# Altium schematic sheet dv_analog_main.SchDoc: =GlobalProjectName
size 209 x 297 mm; DocumentNumber: 2; SheetNumber: 1; SheetTotal: 2; PageSetup: Record=PageOptions|CenterHorizontal=True|CenterVertical=True|PrintScale=1.00|XCorrection=1.00|YCorrection=1.00|PrintKind=1|BorderSize=5000000|LeftOffset=0|BottomOffset=0|Orientation=2|PaperLength=1000|PaperWidth=1000|Scale=100|PaperSource=15|PrintQuality=1200|MediaType=1|DitherType=10|PaperKind=A3|PrintScaleMode=1; Weight: -; ScaleFactor: -
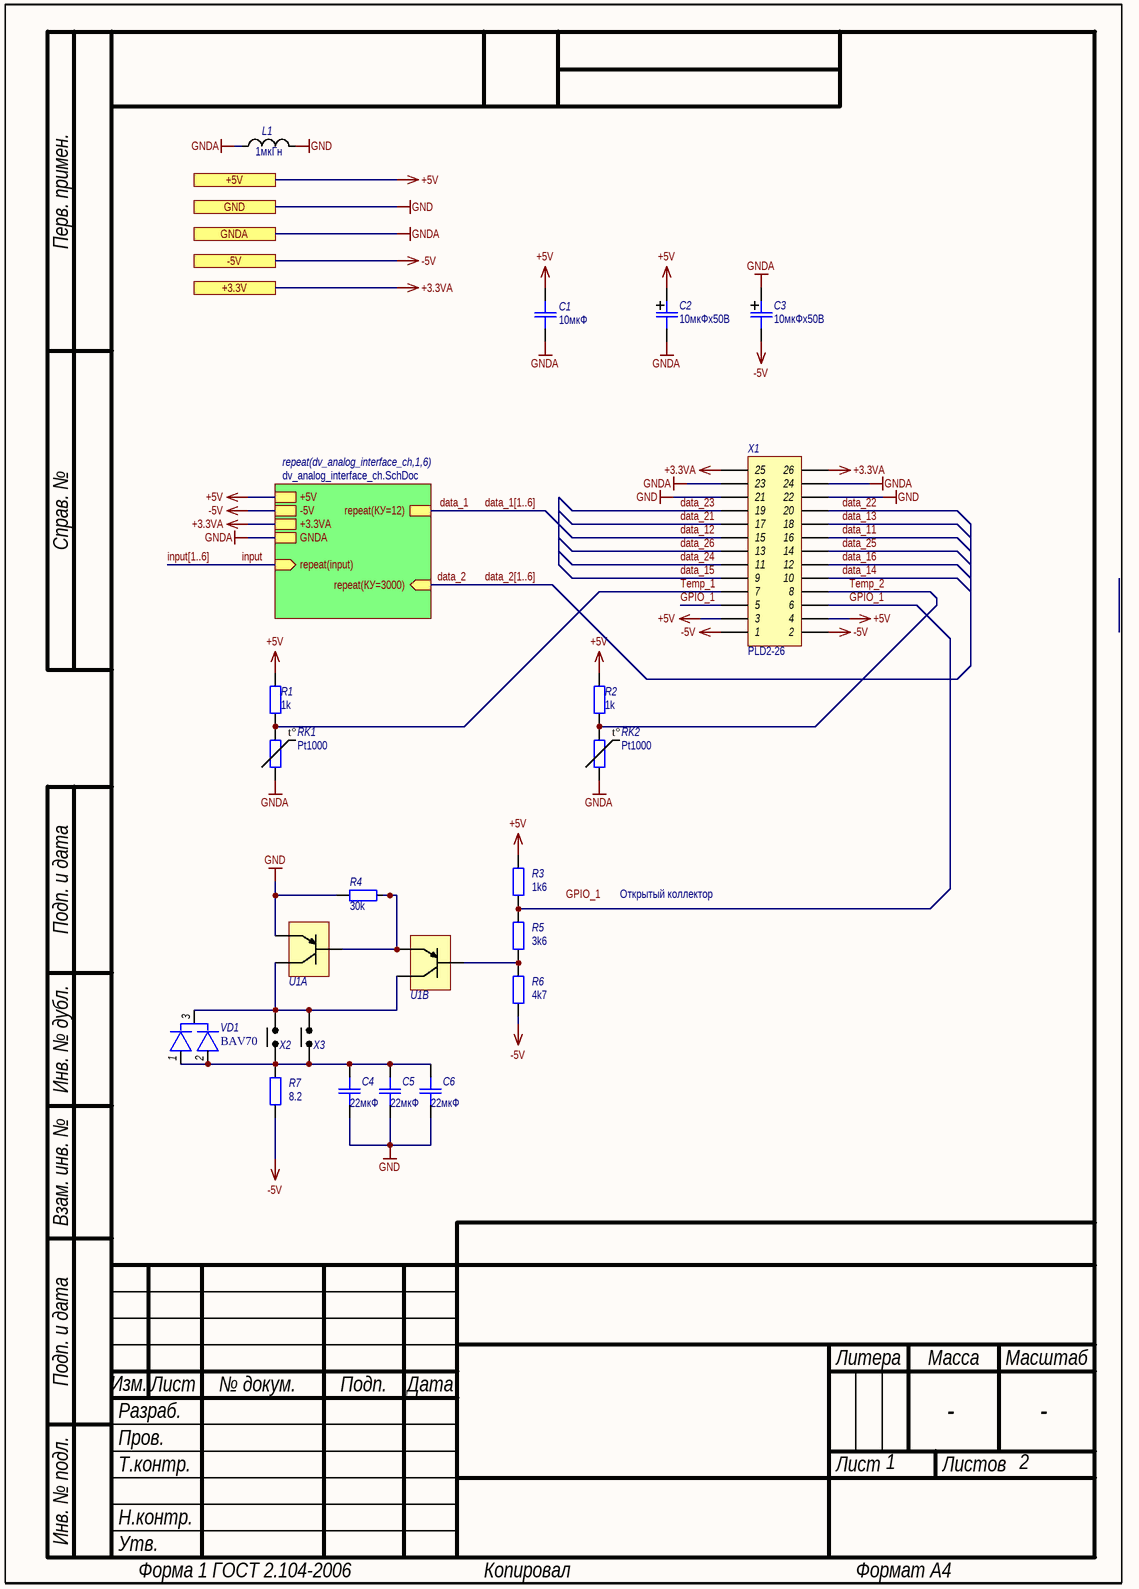
[diagram p0: dv_analog_main.SchDoc]

## Parts
C1  value 10мкФ  [SMD_C0805]  (hidden comment: K10-79)
C2  value 10мкФх50В  [SMD_size_B]  (hidden comment: OS K53-68)
C3  value 10мкФх50В  [SMD_size_B]  (hidden comment: OS K53-68)
C4  value 22мкФ  [SMD_C1206]  (hidden comment: K10-79)
C5  value 22мкФ  [SMD_C1206]  (hidden comment: K10-79)
C6  value 22мкФ  [SMD_C1206]  (hidden comment: K10-79)
L1  value 1мкГн  [SMD_0805]  (hidden comment: Inductor)
R1  value 1k  [SMD_0805]  (hidden comment: OSM R1-12)
R2  value 1k  [SMD_0805]  (hidden comment: OSM R1-12)
R3  value 1k6  [SMD_0805]  (hidden comment: OSM R1-12)
R4  value 30k  [SMD_0805]  (hidden comment: OSM R1-12)
R5  value 3k6  [SMD_0805]  (hidden comment: OSM R1-12)
R6  value 4k7  [SMD_0805]  (hidden comment: OSM R1-12)
R7  value 8.2  [SMD_0805]  (hidden comment: OSM R1-12)
RK1  Pt1000  [Pt1000_3.0x1.0]
RK2  Pt1000  [Pt1000_3.0x1.0]
U1  2ТС622А1 OC  [14PIN FLATPACK]  (value not drawn)  (parts A,B of 4)
VD1  BAV70  [SOT-23]
X1  Header 2X26  [PLD2-26]  (value not drawn)
X2  Jumper 2  [PLS-2]  (value not drawn)
X3  Jumper 2  [PLS-2]  (value not drawn)

## Sub-sheets
repeat(dv_analog_interface_ch,1,6) = dv_analog_interface_ch.SchDoc: GNDA, repeat(input) (in), +5V, +3.3VA, -5V, repeat(КУ=12), repeat(КУ=3000) (in)

## Ports
+3.3V, +5V, -5V, GND, GNDA

## Nets
+3.3VA: X1.25 X1.26 ; port +3.3V, sheet repeat(dv_analog_interface_ch,1,6)/+3.3VA
+5V: C1.2 C2.1 R1.2 R2.2 R3.2 X1.3 X1.4 ; port +5V, sheet repeat(dv_analog_interface_ch,1,6)/+5V
-5V: C3.2 R6.1 R7.2 X1.1 X1.2 ; port -5V, sheet repeat(dv_analog_interface_ch,1,6)/-5V
GND: C4.2 C5.2 C6.2 L1.2 R4.2 U1.13(Эммитер) X1.21 X1.22 ; port GND
GNDA: C1.1 C2.2 C3.1 L1.1 RK1.2 RK2.2 X1.23 X1.24 ; port GNDA, sheet repeat(dv_analog_interface_ch,1,6)/GNDA
data_1: sheet repeat(dv_analog_interface_ch,1,6)/repeat(КУ=12)
data_2: sheet repeat(dv_analog_interface_ch,1,6)/repeat(КУ=3000)
data_11: X1.16
data_12: X1.15
data_13: X1.18
data_14: X1.10
data_15: X1.9
data_16: X1.12
data_21: X1.17
data_22: X1.20
data_23: X1.19
data_24: X1.11
data_25: X1.14
data_26: X1.13
GPIO_1: R3.1 R5.2 X1.5 X1.6
input: sheet repeat(dv_analog_interface_ch,1,6)/repeat(input)
Temp_1: R1.1 RK1.1 X1.7
Temp_2: R2.1 RK2.1 X1.8
NetC4_1: C4.1 C5.1 C6.1 R7.1 VD1.1 VD1.2 X2.1 X3.1
NetR4_1: R4.1 U1.2(База) U1.3(Эммитер)
NetR5_1: R5.1 R6.2 U1.12(База)
NetU1_4: U1.4(Коллектор) U1.14(Коллектор) VD1.3 X2.2 X3.2

## Buses and harness runs
bus data_1[1..6]
bus data_2[1..6]
bus input[1..6]

## Notes on the sheet
- Открытый коллектор
- Labels drawn without touching a wire or pin: GPIO_1
- Перв. примен.
- Справ. №
- Подп. и дата
- Инв. № дубл.
- Взам. инв. №
- Разраб.
- Изм.
- Лист
- № докум.
- Подп.
- Дата
- Литера
- Масса
- Масштаб
- Пров.
- Т.контр.
- Листов
- Инв. № подл.
- Н.контр.
- Утв.
- Форма 1 ГОСТ 2.104-2006
- Копировал
- Формат А4
- (in symbol Pt1000) t°

## Library data of the parts
C1 C4-C6 = Capacitor: Назначение: SMD-конденсатор; Наименование: К10-79; Потребление, Вт: 0; Напряжение: В; Точность: %
C2 C3 = Capacitor_pol: Polarized capacitor; Назначение: Поляризованный SMD-конденсатор; Наименование: ОС К53-68; Потребление, Вт: 0; Точность: %; Напряжение: В; Диэлектрик: *
L1 = Inductor: Наименование: Индуктивность; Назначение: SMD-индуктивность; Потребление, Вт: 0,010
R1-R7 = Resistor: Наименование: ОСМ Р1-12; Назначение: SMD-резистор; Потребление, Вт: 0,001; Точность: %
RK1 RK2 = Pt1000: Платиновый термометр сопротивления; Value: 1000; Потребление, Вт: 0,001; Назначение: Термометр сопротивления; ComponentLink1Description: DataSheet; ComponentLink1URL: https://ru.mouser.com/datasheet/2/619/M310_HST-USA-1131966.pdf; Наименование: Pt1000
U1 = 2TS622A1 OS: Назначение: Матрица транзисторная; Наименование: 2ТС622А1 OC
VD1 = BAV70: Назначение: Диодная сборка; Наименование: BAV70; ComponentLink1Description: DataSheet; ComponentLink1URL: https://static.chipdip.ru/lib/635/DOC005635893.pdf
X1 = Header 2X26: Header, 26-Pin, Dual row; Назначение: Header, 20-Pin, Dual row; Потребление, Вт: 0,0; Наименование: PLD2-26
X2 X3 = Jumper 2: Jumper, 2-Pin, Dual row; Потребление, Вт: 0,0; Наименование: Jumper 2-pin; Назначение: Jumper, 2-Pin, Dual row